# EAGLE design esp-adapter (EAGLE 7.6.0)
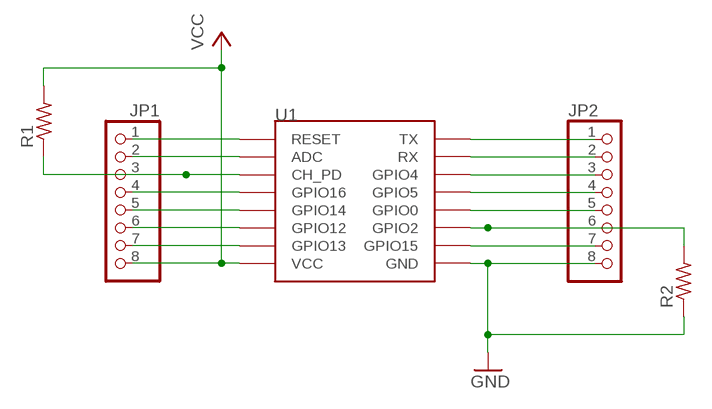
[diagram p0: schematic, sheet 1]

## Parts
JP1  PINHD-1X8  [1X08]
JP2  PINHD-1X8  [1X08]
R1  R-US_R0805  [R0805]
R2  R-US_R0805  [R0805]
U1  ESP12SMD  [ESP12-SMD]

## Nets
GND: JP2.8 R2.1 U1.GND
N$1: JP1.1 U1.RESET
N$2: JP1.2 U1.ADC
N$3: JP1.3 R1.1 U1.CH_PD
N$4: JP1.4 U1.GPIO16
N$5: JP1.5 U1.GPIO14
N$6: JP1.6 U1.GPIO12
N$7: JP1.7 U1.GPIO13
N$9: JP2.1 U1.TXD0(TX)
N$10: JP2.2 U1.RXD0(RX)
N$11: JP2.3 U1.GPIO4
N$12: JP2.4 U1.GPIO5
N$13: JP2.5 U1.GPIO0
N$14: JP2.6 R2.2 U1.GPIO2
N$15: JP2.7 U1.GPIO15
VCC: JP1.8 R1.2 U1.VCC

## Library data of the parts
JP1 JP2 = pinhead:PINHD-1X8: PIN HEADER
R1 R2 = resistor:R-US_: RESISTOR, American symbol
U1 = esp8266modules:ESP12: ESP8266 Wifi module 12

## Board
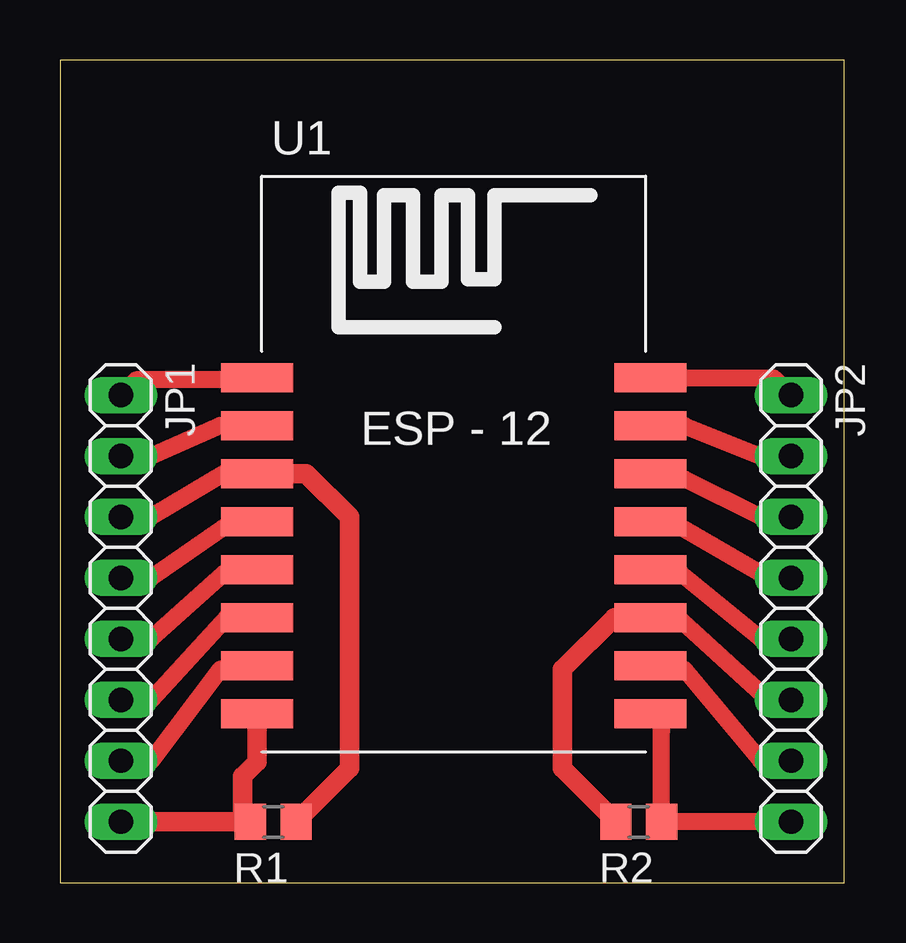
[diagram p1: board, top side]

Size 32.69 x 34.28 mm. Coordinates in mm from the lower left corner, seen from the top.
Outline: 0,0 32.69,0 32.69,34.28 0,34.28 0,0
Copper layers (1*16): Top 0.035mm / dielectric 1.5mm / Bottom 0.035mm
Design rules "default": minimum track width 10mil, minimum drill 24mil, track to track 8mil, track to pad 8mil, pad to pad 8mil, via to via 8mil, smd to smd 8mil, copper to edge 40mil, drill to drill 8mil, minimum pad ring 10mil, minimum via ring 8mil, stop-mask expansion 4mil, vias tented up to drill 0mil, thermal gap 10mil

### Footprints (pad centres in the part's own frame; a part is rotated, then mirrored left to right if it is on the bottom)
1X08 = drill 1.016 long: 1 -8.89,0; 2 -6.35,0; 3 -3.81,0; 4 -1.27,0; 5 1.27,0; 6 3.81,0; 7 6.35,0; 8 8.89,0
R0805 = smd 1.3 x 1.5: 1 -0.95,0; 2 0.95,0
ESP12-SMD = smd 3 x 1.2: ADC -8.3,3.8; CH_PD -8.3,1.8; GND 8.1,-8.2; GPIO0 8.1,-2.2; GPIO2 8.1,-4.2; GPIO4 8.1,1.8; GPIO5 8.1,-0.2; GPIO12 -8.3,-4.2; GPIO13 -8.3,-6.2; GPIO14 -8.3,-2.2; GPIO15 8.1,-6.2; GPIO16 -8.3,-0.2; RESET -8.3,5.8; RXD0 8.1,3.8; TXD0 8.1,5.8; VCC -8.3,-8.2

### Placement (x,y rotation side)
JP1  2.54,11.43 270 top
JP2  30.48,11.43 270 top
R1  8.89,2.54 180 top
R2  24.13,2.54 180 top
U1  16.51,15.24 0 top

### Tracks (layer width: path | path; a pad name or v marks a point on that pad's centre or on a via)
GND
  Top 0.711: JP2.8 R2.1 25.08,6.31 arc45 24.89,6.76 U1.GND
N$1
  Top 0.711: 8.12,20.95 3.18,20.95 JP1.1
  Top 0.813: U1.RESET 8.12,20.95
N$2
  Top 0.711: U1.ADC 6.67,19.05 3.81,17.78 JP1.2
N$3
  Top 0.711: U1.CH_PD 6.98,17.14 3.81,15.24 JP1.3
  Top 0.813: R1.1 12.06,4.76 12.06,15.24 10.27,17.04 U1.CH_PD
N$4
  Top 0.711: U1.GPIO16 6.98,14.92 3.81,12.7 JP1.4
N$5
  Top 0.711: U1.GPIO14 6.98,13.02 3.81,10.16 JP1.5
N$6
  Top 0.711: U1.GPIO12 6.98,11.11 3.81,7.62 JP1.6
N$7
  Top 0.711: U1.GPIO13 6.67,8.89 3.81,5.08 JP1.7
N$9
  Top 0.711: U1.TXD0 29.76,21.04 JP2.1
N$10
  Top 0.711: U1.RXD0 26.04,19.05 29.21,17.78 JP2.2
N$11
  Top 0.711: U1.GPIO4 26.04,16.83 29.21,15.24 JP2.3
N$12
  Top 0.711: U1.GPIO5 25.72,14.92 29.53,12.7 JP2.4
N$13
  Top 0.711: U1.GPIO0 25.72,13.02 29.21,10.16 JP2.5
N$14
  Top 0.711: U1.GPIO2 25.72,11.11 29.53,7.62 JP2.6
  Top 0.813: R2.2 20.95,4.76 20.95,8.89 23.11,11.04 U1.GPIO2
N$15
  Top 0.711: U1.GPIO15 25.72,8.89 26.04,8.89 29.21,5.08 JP2.7
VCC
  Top 0.813: JP1.8 R1.2 7.62,2.86 7.62,4.44 8.21,5.03 U1.VCC